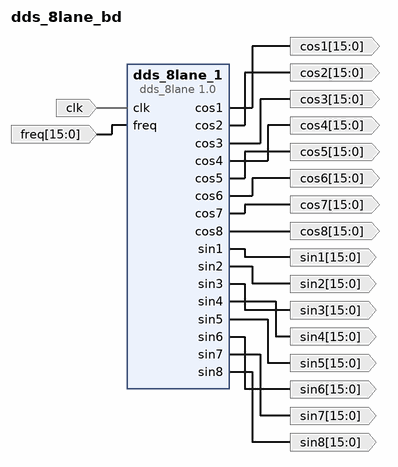
[diagram p0: block diagram of the top level]
# Vivado block design dds_8lane_bd, xc7k160tfbg484-2, Vivado 2021.2
create_bd_design dds_8lane_bd

create_bd_port -dir I -type clk clk
create_bd_port -dir O -from 15 -to 0 -type data cos1
create_bd_port -dir O -from 15 -to 0 -type data cos2
create_bd_port -dir O -from 15 -to 0 -type data cos3
create_bd_port -dir O -from 15 -to 0 -type data cos4
create_bd_port -dir O -from 15 -to 0 -type data cos5
create_bd_port -dir O -from 15 -to 0 -type data cos6
create_bd_port -dir O -from 15 -to 0 -type data cos7
create_bd_port -dir O -from 15 -to 0 -type data cos8
create_bd_port -dir I -from 15 -to 0 -type data freq
create_bd_port -dir O -from 15 -to 0 -type data sin1
create_bd_port -dir O -from 15 -to 0 -type data sin2
create_bd_port -dir O -from 15 -to 0 -type data sin3
create_bd_port -dir O -from 15 -to 0 -type data sin4
create_bd_port -dir O -from 15 -to 0 -type data sin5
create_bd_port -dir O -from 15 -to 0 -type data sin6
create_bd_port -dir O -from 15 -to 0 -type data sin7
create_bd_port -dir O -from 15 -to 0 -type data sin8

create_bd_cell -type ip -vlnv User_Company:SysGen:dds_8lane:1.0 dds_8lane_1

# ---- connections ----

connect_bd_net [get_bd_ports clk] [get_bd_pins dds_8lane_1/clk]
connect_bd_net [get_bd_pins dds_8lane_1/cos1] [get_bd_ports cos1]
connect_bd_net [get_bd_pins dds_8lane_1/cos2] [get_bd_ports cos2]
connect_bd_net [get_bd_pins dds_8lane_1/cos3] [get_bd_ports cos3]
connect_bd_net [get_bd_pins dds_8lane_1/cos4] [get_bd_ports cos4]
connect_bd_net [get_bd_pins dds_8lane_1/cos5] [get_bd_ports cos5]
connect_bd_net [get_bd_pins dds_8lane_1/cos6] [get_bd_ports cos6]
connect_bd_net [get_bd_pins dds_8lane_1/cos7] [get_bd_ports cos7]
connect_bd_net [get_bd_pins dds_8lane_1/cos8] [get_bd_ports cos8]
connect_bd_net [get_bd_pins dds_8lane_1/sin1] [get_bd_ports sin1]
connect_bd_net [get_bd_pins dds_8lane_1/sin2] [get_bd_ports sin2]
connect_bd_net [get_bd_pins dds_8lane_1/sin3] [get_bd_ports sin3]
connect_bd_net [get_bd_pins dds_8lane_1/sin4] [get_bd_ports sin4]
connect_bd_net [get_bd_pins dds_8lane_1/sin5] [get_bd_ports sin5]
connect_bd_net [get_bd_pins dds_8lane_1/sin6] [get_bd_ports sin6]
connect_bd_net [get_bd_pins dds_8lane_1/sin7] [get_bd_ports sin7]
connect_bd_net [get_bd_pins dds_8lane_1/sin8] [get_bd_ports sin8]
connect_bd_net [get_bd_ports freq] [get_bd_pins dds_8lane_1/freq]

validate_bd_design
save_bd_design
